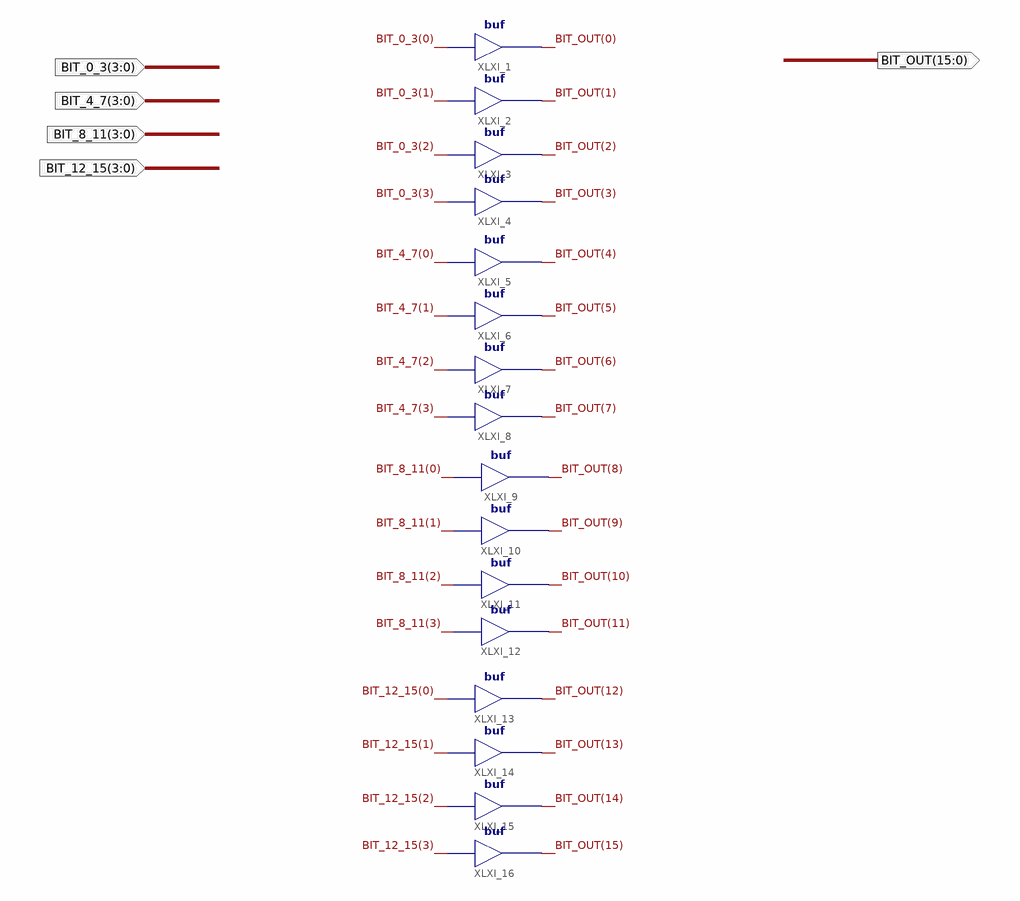
[diagram p0: schematic sheet 1]
// Xilinx ISE schematic Mixbus4_16_1.sch (spartan6) as structural Verilog: 16 symbols, 5 ports
module Mixbus4_16_1 (
  input  [3:0] BIT_0_3,
  input  [3:0] BIT_4_7,
  input  [3:0] BIT_8_11,
  input  [3:0] BIT_12_15,
  output [15:0] BIT_OUT
);

  buf XLXI_1 (BIT_OUT[0], BIT_0_3[0]);
  buf XLXI_2 (BIT_OUT[1], BIT_0_3[1]);
  buf XLXI_3 (BIT_OUT[2], BIT_0_3[2]);
  buf XLXI_4 (BIT_OUT[3], BIT_0_3[3]);
  buf XLXI_5 (BIT_OUT[4], BIT_4_7[0]);
  buf XLXI_6 (BIT_OUT[5], BIT_4_7[1]);
  buf XLXI_7 (BIT_OUT[6], BIT_4_7[2]);
  buf XLXI_8 (BIT_OUT[7], BIT_4_7[3]);
  buf XLXI_9 (BIT_OUT[8], BIT_8_11[0]);
  buf XLXI_10 (BIT_OUT[9], BIT_8_11[1]);
  buf XLXI_11 (BIT_OUT[10], BIT_8_11[2]);
  buf XLXI_12 (BIT_OUT[11], BIT_8_11[3]);
  buf XLXI_13 (BIT_OUT[12], BIT_12_15[0]);
  buf XLXI_14 (BIT_OUT[13], BIT_12_15[1]);
  buf XLXI_15 (BIT_OUT[14], BIT_12_15[2]);
  buf XLXI_16 (BIT_OUT[15], BIT_12_15[3]);
endmodule
